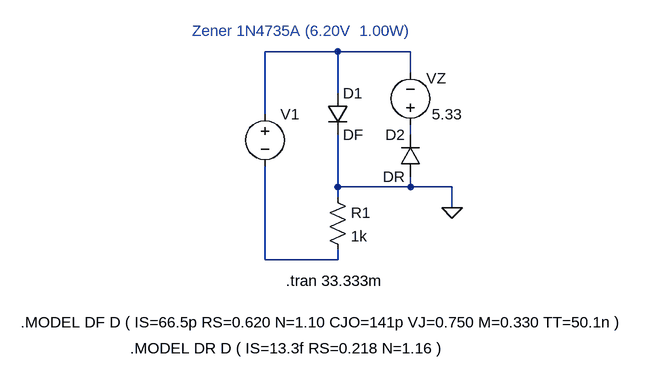
[diagram p0: schematic Diodo_1N4735A_trans.asc]
Diodo_1N4735A_trans.asc, the LTspice schematic file:
Version 4
SHEET 1 880 680
WIRE 192 16 80 16
WIRE 304 16 192 16
WIRE 304 48 304 16
WIRE 192 80 192 16
WIRE 80 112 80 16
WIRE 304 144 304 128
WIRE 192 224 192 144
WIRE 304 224 304 208
WIRE 304 224 192 224
WIRE 368 224 304 224
WIRE 192 240 192 224
WIRE 368 256 368 224
WIRE 80 336 80 192
WIRE 192 336 192 320
WIRE 192 336 80 336
FLAG 368 256 0
SYMBOL res 176 224 R0
SYMATTR InstName R1
SYMATTR Value 1k
SYMBOL voltage 80 96 R0
WINDOW 3 24 96 Invisible 2
WINDOW 123 0 0 Left 0
SYMATTR Value SINE(0 40 30 0 0 0 0)
SYMATTR InstName V1
SYMATTR SpiceLine Rser=0
SYMBOL diode 320 208 R180
WINDOW 0 24 64 Left 2
WINDOW 3 24 0 Left 2
SYMATTR InstName D2
SYMATTR Value DR
SYMBOL diode 176 80 R0
SYMATTR InstName D1
SYMATTR Value DF
SYMBOL voltage 304 144 R180
WINDOW 0 -55 87 Left 2
WINDOW 3 -80 32 Left 2
SYMATTR InstName VZ
SYMATTR Value 5.33
TEXT 112 368 Left 2 !.tran 33.333m
TEXT -296 432 Left 2 !.MODEL DF D ( IS=66.5p RS=0.620 N=1.10 CJO=141p VJ=0.750 M=0.330 TT=50.1n )
TEXT -128 472 Left 2 !.MODEL DR D ( IS=13.3f RS=0.218 N=1.16 )
TEXT -32 -16 Left 2 ;Zener 1N4735A (6.20V  1.00W)

The netlist it stands for:
* Diodo_1N4735A_trans.asc
R1 0 N003 1k
V1 N001 N003 SINE(0 40 30 0 0 0 0) Rser=0
D2 0 N002 DR
D1 N001 0 DF
VZ N002 N001 5.33
.model D D
.lib standard.dio
.tran 33.333m
.MODEL DF D ( IS=66.5p RS=0.620 N=1.10 CJO=141p VJ=0.750 M=0.330 TT=50.1n )
.MODEL DR D ( IS=13.3f RS=0.218 N=1.16 )
* Zener 1N4735A (6.20V  1.00W)
.backanno
.end